# Altium project ESP32 Tool Board.PrjPcb
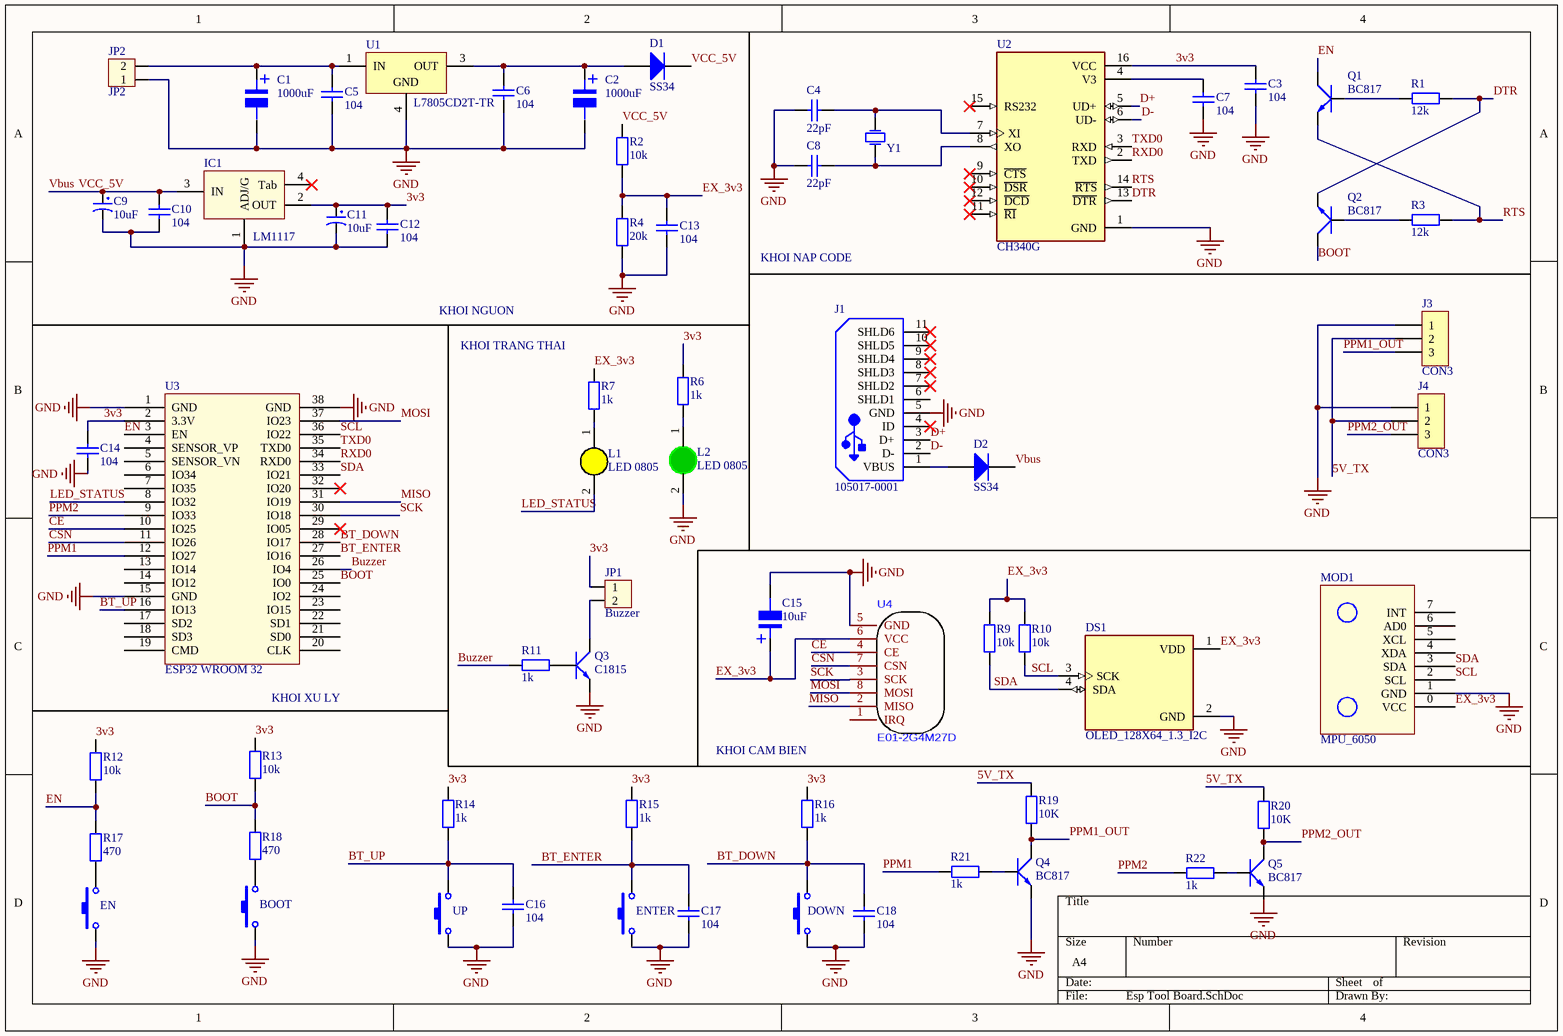
[diagram p0: Esp Tool Board.SchDoc]
1 sheet, 65 parts. Net scope: global (net labels, ports and power ports of the same name join across sheets).
Board file: Esp Tool Board.PcbDoc

## Sheet Esp Tool Board.SchDoc
size A4; SheetNumber: 1; SheetTotal: 1

### Parts
BOOT  Nut Nhan 2 Chan SMD 3x6x2.5  [Nut Nhan 2 Chan SMD 3x6x2.5]  (value not drawn)
C1  1000uF  [tu nhom 10 (G)]
C2  1000uF  [tu nhom 10 (G)]
C3  104  [Cap 0603]
C4  22pF  [tu 0603]
C5  104  [Cap 0805]
C6  104  [Cap 0805]
C7  104  [Cap 0603]
C8  22pF  [tu 0603]
C9  10uF  [tu tantalum smd7343]
C10  104  [Cap 0603]
C11  10uF  [tu tantalum smd7343]
C12  104  [Cap 0603]
C13  104  [Cap 0805]
C14  104  [Cap 0805]
C15  10uF  [tu nhom 5 (c)]
C16  104  [Cap 0603]
C17  104  [Cap 0603]
C18  104  [Cap 0603]
D1  SS34  [DIODE SMA]
D2  SS34  [DIODE SMA]
DOWN  Nut Nhan 2 Chan SMD 3x6x2.5  [Nut Nhan 2 Chan SMD 3x6x2.5]  (value not drawn)
DS1  OLED_128X64_1.3_I2C  [LCD_OLED_128X64_1.3_I2C]
EN  Nut Nhan 2 Chan SMD 3x6x2.5  [Nut Nhan 2 Chan SMD 3x6x2.5]  (value not drawn)
ENTER  Nut Nhan 2 Chan SMD 3x6x2.5  [Nut Nhan 2 Chan SMD 3x6x2.5]  (value not drawn)
IC1  LM1117  [SOT223-4N]
J1  105017-0001  [USB-MICRO-B_V]
J3  CON3  [CON3]
J4  CON3  [CON3]
JP1  Buzzer  [CON2]
JP2  JP2  [CON2]
L1  LED 0805  [LED-0805-Yellow]
L2  LED 0805  [LED-0805-Green]
MOD1  MPU_6050  [MOD MPU-6050]
Q1  BC817  [SOT-23]
Q2  BC817  [SOT-23]
Q3  C1815  [SOT-23]
Q4  BC817  [SOT-23]
Q5  BC817  [SOT-23]
R1  12k  [tro smd 0805]
R2  10k  [tro smd 0805]
R3  12k  [tro smd 0805]
R4  20k  [tro smd 0805]
R6  1k  [tro smd 0805]
R7  1k  [tro smd 0805]
R9  10k  [tro smd 0603]
R10  10k  [tro smd 0603]
R11  1k  [tro smd 0603]
R12  10k  [tro smd 0805]
R13  10k  [tro smd 0805]
R14  1k  [tro smd 0603]
R15  1k  [tro smd 0603]
R16  1k  [tro smd 0603]
R17  470  [Tro SMD 0805]
R18  470  [Tro SMD 0805]
R19  10K  [tro smd 0805]
R20  10K  [tro smd 0805]
R21  1k  [tro smd 0805]
R22  1k  [tro smd 0805]
U1  L7805CD2T-TR  [TO-263_N]
U2  CH340G  [CH340G]
U3  ESP32 WROOM 32  [ESP32-WROOM-32D]
U4  E01-2G4M27D  [E01-2G4M27D]
UP  Nut Nhan 2 Chan SMD 3x6x2.5  [Nut Nhan 2 Chan SMD 3x6x2.5]  (value not drawn)
Y1  32MHz  [THACH ANH DAN 3215]  (value not drawn)

### Nets
GND: BOOT.1 C1.2 C3.2 C4.1 C5.1 C7.2 C8.1 C9.2 C10.2 C11.2 C12.2 C13.2 C14.2 C15.2 C16.2 C17.2 C18.2 DOWN.1 DS1.2(GND) EN.1 ENTER.1 IC1.1(ADJ/G) J1.5(GND) J3.1 J4.1 JP2.1 L2.2(K) MOD1.1(GND) Q3.2(E) Q4.2(E) Q5.2(E) R4.1 U1.4(GND) U2.1(GND) U3.1(GND) U3.15(GND) U3.38(GND) U4.5(GND) UP.1
3v3: C3.1 C11.1 C12.1 C14.1 IC1.2(OUT) JP1.1 R6.2 R12.2 R13.2 R14.2 R15.2 R16.2 U2.16(VCC) U3.2(3.3V)
5V_TX: J3.2 J4.2 R19.2 R20.2
BOOT: Q2.3(C) R13.1 R18.2 U3.25(IO0)
BT_DOWN: C18.1 DOWN.2 R16.1 U3.28(IO17)
BT_ENTER: C17.1 ENTER.2 R15.1 U3.27(IO16)
BT_UP: C16.1 R14.1 U3.16(IO13) UP.2
Buzzer: R11.2 U3.26(IO4)
CE: U3.10(IO25) U4.4(CE)
CSN: U3.11(IO26) U4.7(CSN)
D+: J1.3(D+) U2.5(UD+)
D-: J1.2(D-) U2.6(UD-)
DTR: Q2.2(E) R1.2 U2.13(~{DTR})
EN: Q1.3(C) R12.1 R17.2 U3.3(EN)
EX_3v3: C13.1 C15.1 DS1.1(VDD) MOD1.0(VCC) R2.1 R4.2 R7.2 R9.2 R10.2 U4.6(VCC)
LED_STATUS: L1.2(K) U3.8(IO32)
MISO: U3.31(IO19) U4.2(MISO)
MOSI: U3.37(IO23) U4.8(MOSI)
PPM1: R21.1 U3.12(IO27)
PPM1_OUT: J3.3 Q4.3(C) R19.1
PPM2: R22.1 U3.9(IO33)
PPM2_OUT: J4.3 Q5.3(C) R20.1
RTS: Q1.2(E) R3.2 U2.14(~{RTS})
RXD0: U2.2(TXD) U3.34(RXD0)
SCK: U3.30(IO18) U4.3(SCK)
SCL: DS1.3(SCK) MOD1.2(SCL) R10.1 U3.36(IO22)
SDA: DS1.4(SDA) MOD1.3(SDA) R9.1 U3.33(IO21)
TXD0: U2.3(RXD) U3.35(TXD0)
Vbus: C9.1 C10.1 D1.2(K) D2.2(K) IC1.3(IN) R2.2  [also labelled VCC_5V]
NetBOOT_2: BOOT.2 R18.1
NetC1_1: C1.1 C5.2 JP2.2 U1.1(IN)
NetC2_1: C2.1 C6.2 D1.1(A) U1.3(OUT)
NetC2_2: C2.2 C6.1
NetC4_2: C4.2 U2.7(XI) Y1.1(OSC1)
NetC7_1: C7.1 U2.4(V3)
NetC8_2: C8.2 U2.8(XO) Y1.2(OSC2)
NetD2_1: D2.1(A) J1.1(VBUS)
NetEN_2: EN.2 R17.1
NetJP1_2: JP1.2 Q3.3(C)
NetL1_1: L1.1(A) R7.1
NetL2_1: L2.1(A) R6.1
NetQ1_1: Q1.1(B) R1.1
NetQ2_1: Q2.1(B) R3.1
NetQ3_1: Q3.1(B) R11.1
NetQ4_1: Q4.1(B) R21.2
NetQ5_1: Q5.1(B) R22.2

Not connected (* = marked no-connect by the designer): IC1 4(Tab)*; J1 4(ID)* 6(SHLD1) 7(SHLD2)* 8(SHLD3)* 9(SHLD4)* 10(SHLD5)* 11(SHLD6)*; MOD1 4(XDA) 5(XCL) 6(AD0) 7(INT); U2 9(~{CTS})* 10(~{DSR})* 11(~{RI})* 12(~{DCD})* 15(RS232)*; U3 4(SENSOR_VP) 5(SENSOR_VN) 6(IO34) 7(IO35) 13(IO14) 14(IO12) 17(SD2) 18(SD3) 19(CMD) 20(CLK) 21(SD0) 22(SD1) 23(IO15) 24(IO2) 29(IO05)* 32(IO20)*; U4 1(IRQ)

### Notes on the sheet
- KHOI NGUON
- KHOI NAP CODE
- (near R7) KHOI TRANG THAI
- KHOI XU LY
- (near R16) KHOI CAM BIEN
- (in symbol Tu Nhom 10uF 50V) +
- (in symbol Tu Nhom 1000uF 16V) +

### Library data of the parts
BOOT DOWN EN ENTER UP = Nut Nhan 2 Chan SMD 3x6x2.5: Ma_Hang: MH001036; Ten: Nút Nhấn 2 Chân 3x6x2.5MM SMD
C1 C2 = Tu Nhom 1000uF 16V: Dán; Don_Vi: Con; So_Chan: 2; Ten_Linh_Kien: Tụ Nhôm 1000uF 16V 10x10MM; Ma_Hang: MH004419; Chung_Loai: Dán; Kieu_Chan: *
C3 C7 C10 C12 C16-C18 = Tu 0603 104 50V 10%: SMD 0.1 µF (100 nF); Chung_Loai: Dán; Don_Vi: Con; So_Chan: 2; Ten_Linh_Kien: Tụ 0603 104-100nF 10% 50V; Ma_Hang: MH004568; Kieu_Chan: *
C4 C8 = Tu 0603 22pF 50V 10%: SMD; Chung_Loai: Dán; Don_Vi: Con; So_Chan: 2; Ten_Linh_Kien: Tụ 0603 22pF 50V 10%; Ma_Hang: MH004570; Kieu_Chan: *
C5 C6 C13 C14 = Tu 0805 104 50V 10%: SMD 0.1 µF (100 nF); Chung_Loai: Dán; Don_Vi: Con; So_Chan: 2; Ten_Linh_Kien: Tụ 0805 104-100nF 10% 50V; Ma_Hang: MH004551; Kieu_Chan: *
C9 C11 = Tu tantalum 10uF 50V SMD7343: Dán; Don_Vi: Con; So_Chan: 2; Ten_Linh_Kien: Tụ tantalum 106T-10uF 50V SMD7343; Ma_Hang: MH006532; Chung_Loai: Dán; Kieu_Chan: *
C15 = Tu Nhom 10uF 50V: Dán; Don_Vi: Con; So_Chan: 2; Ten_Linh_Kien: Tụ Nhôm 10uF 50V 5x5MM; Ma_Hang: MH002229; Chung_Loai: Dán; Kieu_Chan: *
D1 D2 = Diode SS34 ( 1N5822 ): Dán; Don_Vi: Con; Ma_Hang: MH002104; Ten_Linh_Kien: Diode SS34 3A 40V SMA ( 1N5822 SS34A); Kieu_Chan: *; Chung_Loai: Dán
DS1 = OLED_128X64_1.3_I2C: Non-Touch Graphic LCD Display Module Transmissive White OLED, Monochrome I2C 1.3 (33.02mm) 128 x 64; MF: UNIVERSAL-SOLDER Electronics Ltd; MP: OLED 128x64 1.3&quot; I2C; SnapEDA_Link: https://www.snapeda.com/parts/OLED%20128x64%201.3%22%20I2C/UNIVERSAL-SOLDER+Electronics+Ltd/view-part/?ref=snap; Package: None; Value: *; Check_prices: https://www.snapeda.com/parts/OLED%20128x64%201.3%22%20I2C/UNIVERSAL-SOLDER+Electronics+Ltd/view-part/?ref=eda
IC1 = LM1117: 3v3; Value: LM317
J1 = CMP-2000-05827-1: Micro-USB B Receptacle, Right Angle, Bottom Mount, Surface Mount, with Solder Tabs, -30 to 85 degC, 5-Pin USB, RoHS, Tape and Reel; Manufacturer: Molex; Featured Product: Micro-USBConnectorsUSBConnectors; Other Names: WM1399DKR; Package Version: Rev. F, 12/2012; Number of Contacts: 5; Connector Type: USB-microB; Catalog Drawings: 1050170001; 3D Model: 105017-0001.stp; Mating Products: WM17145-ND-CABLEMICROUSBBTOSTDA1.0MWM17147-ND-CABLEMICROUSBBTOSTDA2.0MWM17146-ND-CABLEMICROUSBBTOSTDA1.5M; PCN Assembly/Origin: ResinSupplier21/Oct/2015; Voltage - Max: 30V; Online Catalog: Molex-MicroUSB; Manufacturer URL: http://www.molex.com/; Package Description: 5-Leads USB, Micro B, Body 7.5 x 5 mm, Pitch 0.65 mm; Datasheet URL: http://www.molex.com/elqNow/elqRedir.htm?ref=http://www.molex.com/webdocs/datasheets/pdf/en-us/1050170001_IO_CONNECTORS.pdf; Ingress Protection: -; Datasheet Version: 03/2016; Mounting Type: BoardCutout,SurfaceMount,RightAngle; Circuits: 5; Standard Package: 1; Package Reference: MICRO-B; Package URL: http://www.molex.com/pdm_docs/sd/1050170001_sd.pdf; Category: Connectors,Interconnects; Series: -; RoHS Information: 1050170001CertofCompliance; Features: Shielded,SolderRetention; Family: USB,DVI,HDMIConnectors; Specifications: -; Gender: Receptacle; Packaging: Digi-Reel®; Mounting Technology: SurfaceMount
J3 J4 = CON3: Connector
JP1 JP2 = CON2: Connector 2; Value: Connector 2
L1 = LED 0805 Vang: Dán; Don_Vi: Con; Ma_Hang: MH002329; Ten_Linh_Kien: LED 0805 Màu Vàng ( Yellow); Ghi_Chu: *; Kieu_Chan: *; Chung_Loai: Dán
L2 = LED 0805 Xanh La: Dán; Don_Vi: Con; Ma_Hang: MH002326; Ten_Linh_Kien: LED 0805 Màu Xanh Lá (Green); Ghi_Chu: *; Kieu_Chan: *; Chung_Loai: Dán
Q1 Q2 Q4 Q5 = Trans BC817: SOT-23 - C8658; Value: C9014
Q3 = Trans C1815 HF SMD: SOT-23; Value: C9014
R1 R3 = Tro 0805 5% 12k: Dán; Don_Vi: Con; So_Chan: 2; Ten_Linh_Kien: Trở 0805 5% 12k; Ma_Hang: MH005241; Chung_Loai: Dán; Kieu_Chan: *
R2 = Tro 0805 5% 10k: Dán; Don_Vi: Con; So_Chan: 2; Ten_Linh_Kien: Trở 0805 5% 10k; Ma_Hang: MH005239; Chung_Loai: Dán; Kieu_Chan: *
R4 = Tro 0805 5% 20k: Dán; Don_Vi: Con; So_Chan: 2; Ten_Linh_Kien: Trở 0805 5% 20k; Ma_Hang: MH005247; Chung_Loai: Dán; Kieu_Chan: *
R6 R7 = Tro 0805 1% 1k: Dán; Don_Vi: Con; So_Chan: 2; Ten_Linh_Kien: Trở 0805 1% 1k; Ma_Hang: MH005468; Chung_Loai: Dán; Kieu_Chan: *
R9-R11 = Tro 0603 5% 10k: Dán; Don_Vi: Con; So_Chan: 2; Ten_Linh_Kien: Trở 0603 5% 10k; Ma_Hang: MH006316; Chung_Loai: Dán; Kieu_Chan: *
R12 R13 = Tro 0805 1% 10k: Dán; Don_Vi: Con; So_Chan: 2; Ten_Linh_Kien: Trở 0805 1% 10k; Ma_Hang: MH005473; Chung_Loai: Dán; Kieu_Chan: *
R14-R16 = Tro 0603 5% 100R: Dán; Don_Vi: Con; So_Chan: 2; Ten_Linh_Kien: Trở 0603 5% 100R; Ma_Hang: MH006315; Chung_Loai: Dán; Kieu_Chan: *
R17 R18 = Tro 0805 5% 470k: Dán; Don_Vi: Con; Ma_Hang: MH005340; So_Chan: 2; Ten_Linh_Kien: Trở 0805 5% 470k; Chung_Loai: Dán; Kieu_Chan: *
R19-R22 = Tro 0805 5% 1k: Dán; Don_Vi: Con; So_Chan: 2; Ten_Linh_Kien: Trở 0805 5% 1k; Ma_Hang: MH005234; Chung_Loai: Dán; Kieu_Chan: *
U1 = LM7805 TO 263: Positive Voltage Regulator, 3-Pin D2PAK, Tape and Reel; PackageReference: TO-263; ComponentLink2URL: http://www.st.com/internet/com/TECHNICAL_RESOURCES/TECHNICAL_LITERATURE/DATASHEET/CD00000444.pdf; PackageDescription: 3-Pin Transistor Outline Package 2.54 mm Pitch, 15.4 mm Lead Span (D2PAK); DatasheetVersion: 16/11/2011; ComponentLink2Description: Datasheet; ComponentLink1Description: Manufacturer URL; PackageVersion: 2011; ComponentLink1URL: http://www.st.com
U2 = CH340G: USB Interface Integrated Circuit
U4 = E01-2G4M27D: Ebyte E01-ML01DP5 is similar to NRF24L01 + PA + LNA. Those RF modules work at the same frequency (2.4GHz). The Ebyte E01-ML01DP5 is the better version and have more reliability and stability.
Y1 = Thach Anh SMD 3225: C700805; Chung_Loai: Dán; Ten_Linh_Kien: Thạch Anh 16Mhz SMD5032; Ma_Hang: MH001979; Don_Vi: Con; Ghi_Chu: *; Kieu_Chan: *